# Altium schematic sheet PowerManagement.SchDoc
size A
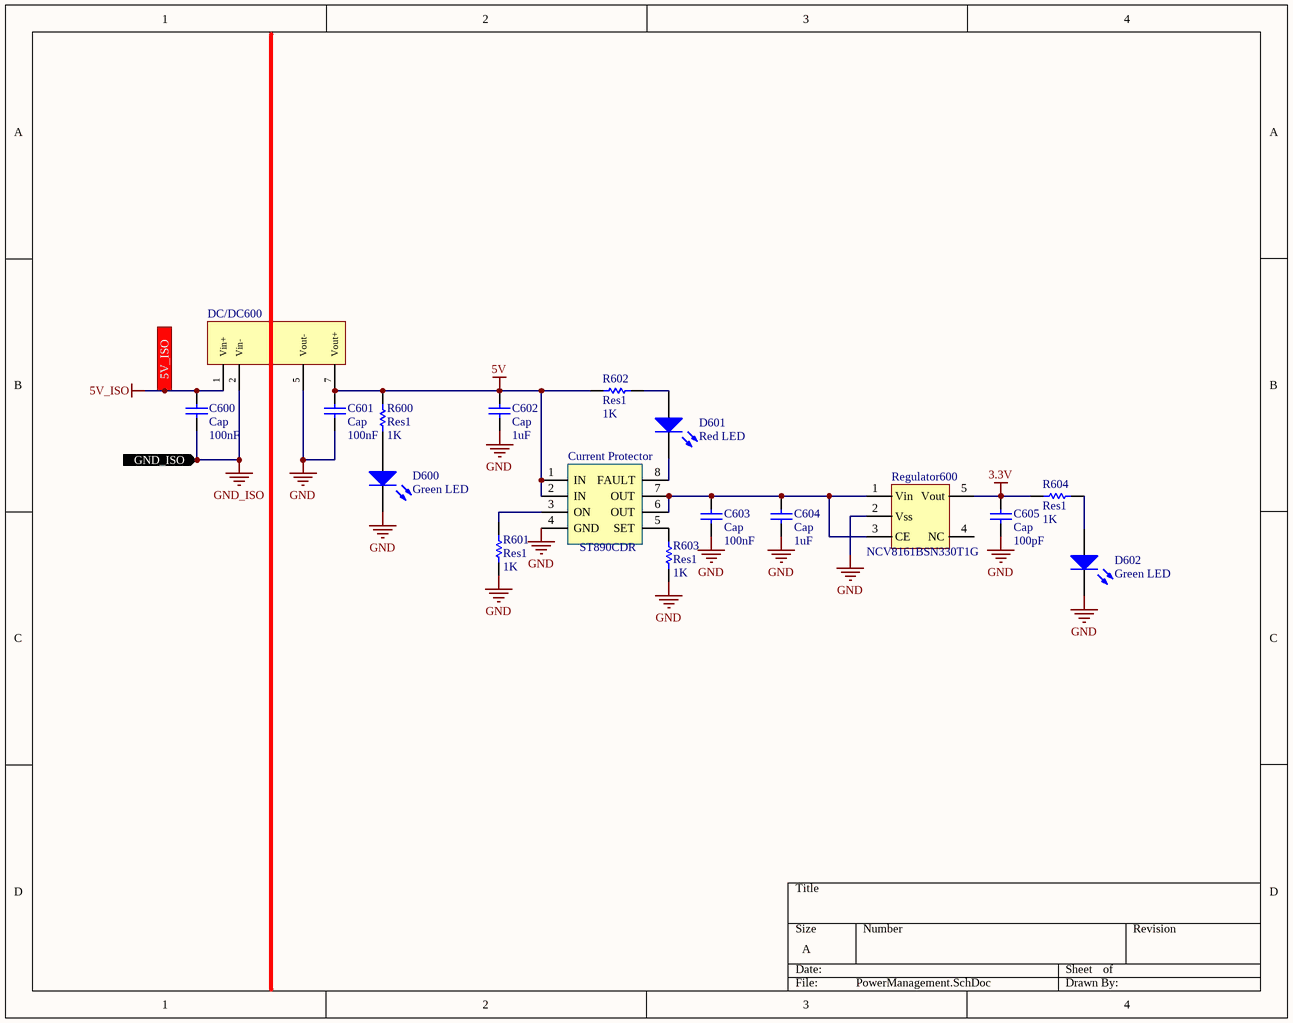
[diagram p0: PowerManagement.SchDoc]

## Parts
C600  Cap  value 100nF  [RAD-0.3]
C601  Cap  value 100nF  [RAD-0.3]
C602  Cap  value 1uF  [RAD-0.3]
C603  Cap  value 100nF  [RAD-0.3]
C604  Cap  value 1uF  [RAD-0.3]
C605  Cap  value 100pF  [RAD-0.3]
Current_Protector  ST890CDR  [SOIC127P600X175-8N]
D600  Green LED  [LED-0]
D601  Red LED  [LED-0]
D602  Green LED  [LED-0]
DC/DC600  Isolated5VDC/DC  [Isolated DC/DC]  (value not drawn)
R600  Res1  value 1K  [AXIAL-0.3]
R601  Res1  value 1K  [AXIAL-0.3]
R602  Res1  value 1K  [AXIAL-0.3]
R603  Res1  value 1K  [AXIAL-0.3]
R604  Res1  value 1K  [AXIAL-0.3]
Regulator600  NCV8161BSN330T1G  [SOT95P280X110-5N]

## Ports
5V_ISO (in), GND_ISO (in)

## Nets
3.3V: C605.1 R604.2 Regulator600.5(Vout)
5V: C601.1 C602.2 Current_Protector.1(IN) Current_Protector.2(IN) DC/DC600.7(Vout+) R600.2 R602.2
5V_ISO: C600.1 DC/DC600.1(Vin+) ; port 5V_ISO
GND: C601.2 C602.1 C603.2 C604.1 C605.2 Current_Protector.4(GND) D600.2(K) D602.2(K) DC/DC600.5(Vout-) R601.1 R603.1 Regulator600.2(Vss)
GND_ISO: C600.2 DC/DC600.2(Vin-) ; port GND_ISO
NetC603_1: C603.1 C604.2 Current_Protector.6(OUT) Current_Protector.7(OUT) Regulator600.1(Vin) Regulator600.3(CE)
NetCurrent_Protector_3: Current_Protector.3(ON) R601.2
NetCurrent_Protector_5: Current_Protector.5(SET) R603.2
NetCurrent_Protector_8: Current_Protector.8(FAULT) D601.2(K)
NetD600_1: D600.1(A) R600.1
NetD601_1: D601.1(A) R602.1
NetD602_1: D602.1(A) R604.1

Not connected (* = marked no-connect by the designer): Regulator600 4(NC)

## Library data of the parts
C600-C605 = Cap: Capacitor; Published: 8-Jun-2000; LatestRevisionDate: 17-Jul-2002; LatestRevisionNote: Re-released for DXP Platform.; PackageReference: RAD-0.3; Publisher: Altium Limited; PackageDescription: Radial Cap, Thru-Hole; 2 Leads; 0.3 in Pin Spacing
Current_Protector = ST890CDR: 1.2A Current Limited High-Side Power Switch with Thermal Shutdown
D600-D602 = LED0: Typical INFRARED GaAs LED; Published: 8-Jun-2000; LatestRevisionDate: 08-Jul-2005; LatestRevisionNote: Mech Layer 1 removed.; PackageReference: LED-0; Publisher: Altium Limited; PackageDescription: LED; 2 Leads
DC/DC600 = Isolated DC/DC: RKZE-0505S/H Isolated DC/DC Converters 2W 05Vin 5Vout 400mA Single SIP7
R600-R604 = Res1: Resistor; Published: 8-Jun-2000; LatestRevisionDate: 17-Jul-2002; LatestRevisionNote: Re-released for DXP Platform.; PackageReference: AXIAL-0.3; Publisher: Altium Limited; PackageDescription: Axial Device, Thru-Hole; 2 Leads; 0.3 in Pin Spacing
Regulator600 = NCV8161BSN330T1G: 450 mA, Ultra-Low Noise  and High PSRR LDO  Regulator for RF and  Analog Circuits